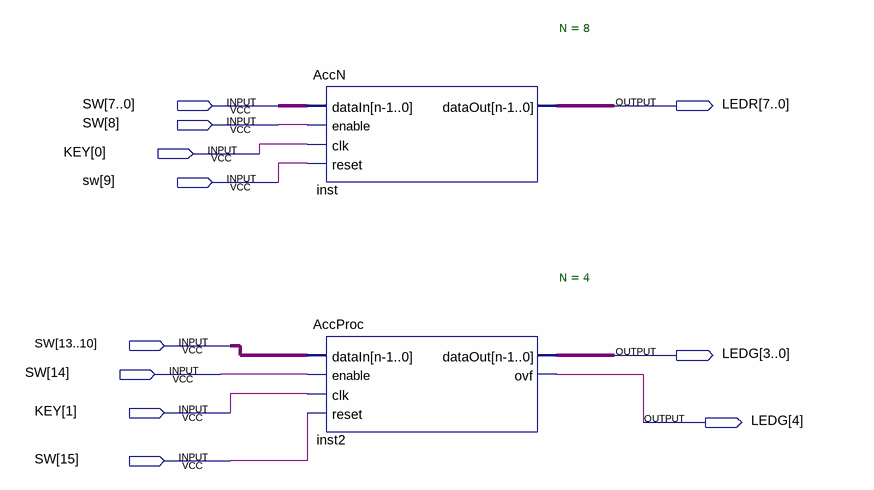
[diagram p0: schematic sheet]
// Quartus schematic AccN_Demo.bdf as structural Verilog: 2 symbols, 11 pins
module AccN_Demo (
  input  [15:0] SW,
  input  [1:0] KEY,
  output [7:0] LEDR,
  output [4:0] LEDG
);

  AccN #(.N(8)) inst (.dataIn(SW[7:0]), .enable(SW[8]), .clk(KEY[0]), .reset(SW[9]), .dataOut(LEDR));
  AccProc #(.N(4)) inst2 (
    .dataIn(SW[13:10]), .enable(SW[14]), .clk(KEY[1]), .reset(SW[15]), .dataOut(LEDG[3:0]), .ovf(LEDG[4]));
endmodule
